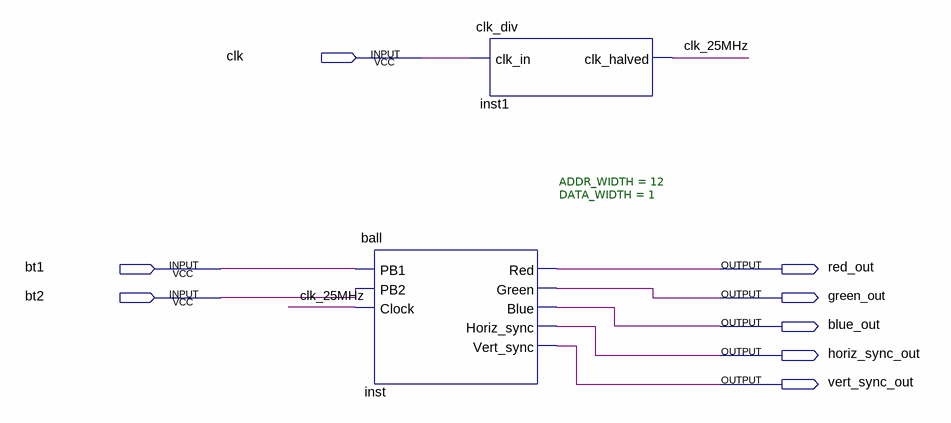
[diagram p0: schematic sheet]
// Quartus schematic Bouncing_ball_example.bdf as structural Verilog: 2 symbols, 8 pins
module Bouncing_ball_example (
  input  clk,
  input  bt1,
  input  bt2,
  output red_out,
  output green_out,
  output blue_out,
  output horiz_sync_out,
  output vert_sync_out
);

  wire clk_25MHz;

  ball #(.ADDR_WIDTH(12), .DATA_WIDTH(1)) inst (
    .PB1(bt1), .PB2(bt2), .Clock(clk_25MHz), .Red(red_out), .Green(green_out), .Blue(blue_out),
    .Horiz_sync(horiz_sync_out), .Vert_sync(vert_sync_out));
  clk_div inst1 (.clk_in(clk), .clk_halved(clk_25MHz));
endmodule
